# EasyEDA Pro project arm project files.epro

# Schematic Schematic1_3
Board Name: PCB2_1; Create Date: 2025-11-03; Page Name: P1; Project Name: arm only; Schematic Name: Schematic1_3; Update Date: 2025-11-03; Company: EasyEDA.com; Page Size: A4; Version: V1.0
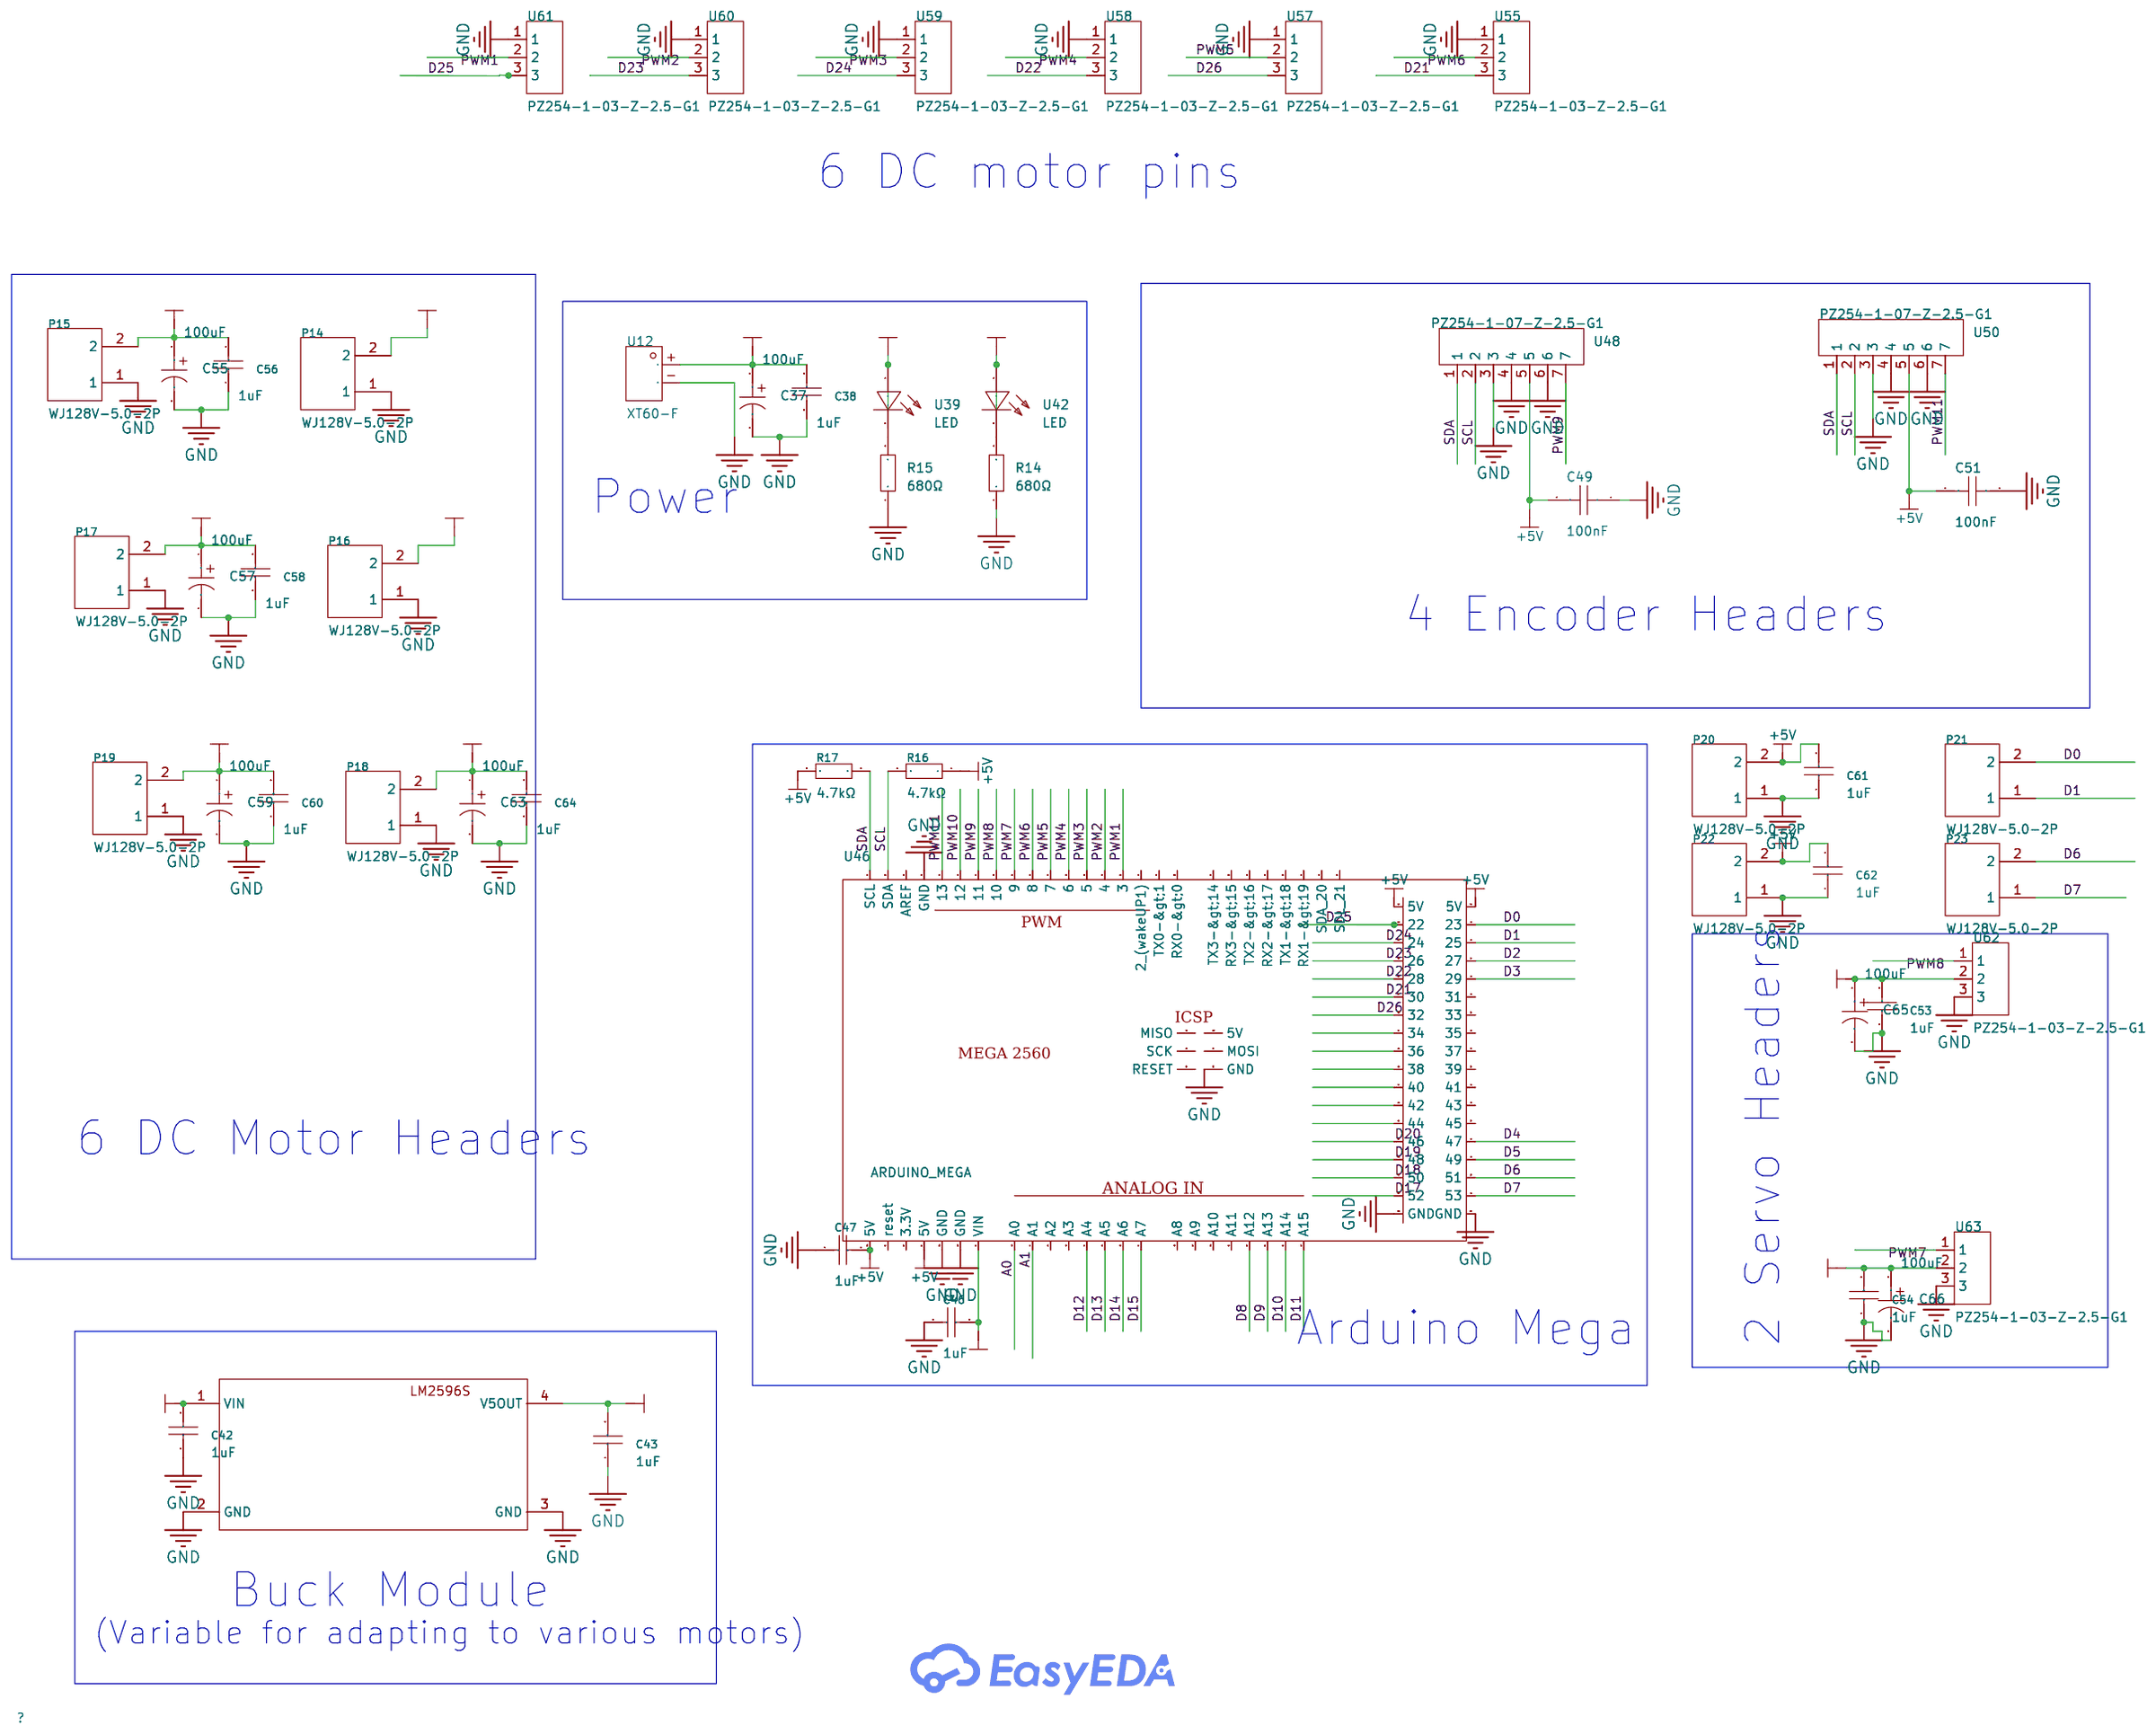
[diagram p0: schematic sheet]

## Parts
C37  100uF  [CAP-TH_BD10.0-P5.00-D0.6-FD]
C38  1uF  [C0805]
C42  1uF  [C0805]
C43  1uF  [C0805]
C46  1uF  [C0805]
C47  1uF  [C0805]
C49  100nF  [C0805]
C51  100nF  [C0805]
C53  1uF  [C0805]
C54  1uF  [C0805]
C55  100uF  [CAP-TH_BD10.0-P5.00-D0.6-FD]
C56  1uF  [C0805]
C57  100uF  [CAP-TH_BD10.0-P5.00-D0.6-FD]
C58  1uF  [C0805]
C59  100uF  [CAP-TH_BD10.0-P5.00-D0.6-FD]
C60  1uF  [C0805]
C61  1uF  [C0805]
C62  1uF  [C0805]
C63  100uF  [CAP-TH_BD10.0-P5.00-D0.6-FD]
C64  1uF  [C0805]
C65  100uF  [CAP-TH_BD10.0-P5.00-D0.6-FD]
C66  100uF  [CAP-TH_BD10.0-P5.00-D0.6-FD]
P14  WJ128V-5.0-2P  [CONN-TH_2P-P5.00_WJ128V-5.0-2P]
P15  WJ128V-5.0-2P  [CONN-TH_2P-P5.00_WJ128V-5.0-2P]
P16  WJ128V-5.0-2P  [CONN-TH_2P-P5.00_WJ128V-5.0-2P]
P17  WJ128V-5.0-2P  [CONN-TH_2P-P5.00_WJ128V-5.0-2P]
P18  WJ128V-5.0-2P  [CONN-TH_2P-P5.00_WJ128V-5.0-2P]
P19  WJ128V-5.0-2P  [CONN-TH_2P-P5.00_WJ128V-5.0-2P]
P20  WJ128V-5.0-2P  [CONN-TH_2P-P5.00_WJ128V-5.0-2P]
P21  WJ128V-5.0-2P  [CONN-TH_2P-P5.00_WJ128V-5.0-2P]
P22  WJ128V-5.0-2P  [CONN-TH_2P-P5.00_WJ128V-5.0-2P]
P23  WJ128V-5.0-2P  [CONN-TH_2P-P5.00_WJ128V-5.0-2P]
R14  680Ω  [R0805]
R15  680Ω  [R0805]
R16  4.7kΩ  [R1206]
R17  4.7kΩ  [R1206]
U12  XT60-F  [CONN-TH_XT60PB-F]
U13  776dda36e34043c08ff071d6b0b84ffa  [LM2596S_FP]
U39  LED  [LED-TH_BD4.0-P2.54-FD_RED]
U42  LED  [LED-TH_BD4.0-P2.54-FD_RED]
U46  ARDUINO_MEGA  [ARDUINO_MEGA2560]
U48  PZ254-1-07-Z-2.5-G1  [HDR-TH_7P-P2.54-V-M]
U50  PZ254-1-07-Z-2.5-G1  [HDR-TH_7P-P2.54-V-M]
U55  PZ254-1-03-Z-2.5-G1  [HDR-TH_3P-P2.54-V-M]
U57  PZ254-1-03-Z-2.5-G1  [HDR-TH_3P-P2.54-V-M]
U58  PZ254-1-03-Z-2.5-G1  [HDR-TH_3P-P2.54-V-M]
U59  PZ254-1-03-Z-2.5-G1  [HDR-TH_3P-P2.54-V-M]
U60  PZ254-1-03-Z-2.5-G1  [HDR-TH_3P-P2.54-V-M]
U61  PZ254-1-03-Z-2.5-G1  [HDR-TH_3P-P2.54-V-M]
U62  PZ254-1-03-Z-2.5-G1  [HDR-TH_3P-P2.54-V-M]
U63  PZ254-1-03-Z-2.5-G1  [HDR-TH_3P-P2.54-V-M]

## Library data of the parts
C37 C55 C57 C59 C63 C65 C66 = 100V100uF CD288: Capacitance:100uF Tolerance:±20% Tolerance:±20% Voltage Rating:100V Pin Spacing:5mm Diameter:10mm Height - Seated (Max):20mm Operating Temperature:-40℃~+105℃ Operating Temperature:-40℃~+105℃; LCSC Part Name: 100uF ±20% 100V; Supplier Part: C2960285; Manufacturer: HRK(鸿瑞凯电子); Supplier Footprint: 插件,D10xL20mm; JLCPCB Part Class: Extended Part; Supplier: LCSC; Tolerance: ±20%; Voltage Rating: 100V; Pin Spacing: 5mm; Diameter: 10mm; Height - Seated (Max): 20mm; Operating Temperature: -40℃~+105℃
C38 C42 C43 C46 C47 C53 C54 C56 C58 C60-C62 C64 = CC0805KKX7R8BB105: Capacitance: Tolerance:±10% Tolerance:±10% Voltage Rated: Temperature Coefficient:; LCSC Part Name: 1uF ±10% 25V; Supplier Part: C91186; Manufacturer: YAGEO(国巨); Supplier Footprint: 0805; JLCPCB Part Class: Extended Part; Datasheet: https://atta.szlcsc.com/upload/public/pdf/source/20170505/1493957848374.pdf; Supplier: LCSC; Tolerance: ±10%
C49 C51 = C0805X104K101T_C485772: Capacitance:100nF Tolerance:±10% Tolerance:±10% Voltage Rating:100V Temperature Coefficient:X7R; LCSC Part Name: 100nF ±10% 100V; Supplier Part: C485772; Manufacturer: IHHEC(禾伸堂); Manufacturer Part: C0805X104K101T; Supplier Footprint: 0805; JLCPCB Part Class: Extended Part; Datasheet: https://item.szlcsc.com/datasheet/C0805X104K101T/494187.html; Supplier: LCSC; Tolerance: ±10%; Voltage Rating: 100V; Temperature Coefficient: X7R
P14-P23 = WJ128V-5.0-2P: Structure:1x2P Pitch:5mm Color:Green Mounting Style:Straight Current Rating (Max):20A Voltage Rating (Max):250V Number of Pins:2P Number of Rows:1 Wire Gauge - AWG:12~22 Wire Gauge - AWG:12~22 Wire Gauge - mm2:2.5 Wire Gauge - mm2:2.5 Number of PINs Per R; LCSC Part Name: 5mm 1x2P 排数:1 每排P数:2 直插; Supplier Part: C8269; Manufacturer: KANGNEX(康奈克斯电气); Supplier Footprint: 插件,P=5mm; JLCPCB Part Class: Extended Part; Datasheet: https://atta.szlcsc.com/upload/public/pdf/source/20191225/C8269_1FF44D6D2E83DB14A7CA266A410FD9AD.pdf; Supplier: LCSC; Structure: 1x2P; Pitch: 5mm; Color: Green; Mounting Style: Straight; Current Rating (Max): 20A; Voltage Rating (Max): 250V; Number of Pins: 2P; Number of Rows: 1; Wire Gauge - AWG: 12~22; Wire Gauge - mm2: 2.5; Number of PINs Per Row: 2; Operating Temperature Range: -40℃~+105℃
R14 R15 = CR0805F86800G: Type:Thick Film Resistor Resistance:680Ω Tolerance:±1% Tolerance:±1% Power(Watts):125mW Voltage-Supply(Max):150V Temperature Coefficient:±100ppm/℃ Temperature Coefficient:±100ppm/℃ Operating Temperature:-55℃~+125℃ Operating Temperature:-55℃~+125℃; LCSC Part Name: 厚膜电阻 680Ω ±1% 125mW; Supplier Part: C101832; Manufacturer: LIZ(丽智电子); Supplier Footprint: 0805; JLCPCB Part Class: Extended Part; Datasheet: https://item.szlcsc.com/datasheet/CR0805F86800G/103047.html; Supplier: LCSC; Type: Thick Film Resistor; Tolerance: ±1%; Power(Watts): 125mW; Voltage-Supply(Max): 150V; Temperature Coefficient: ±100ppm/℃; Operating Temperature: -55℃~+125℃
R16 R17 = RMC12064.7K5%N: Type:Thick Film Resistor Resistance:4.7kΩ Tolerance:±5% Tolerance:±5% Power(Watts):250mW Voltage-Supply(Max):200V Temperature Coefficient:±100ppm/℃ Temperature Coefficient:±100ppm/℃ Operating Temperature:-55℃~+155℃ Operating Temperature:-55℃~+155℃; LCSC Part Name: 厚膜电阻 4.7kΩ ±5% 250mW; Supplier Part: C269760; Manufacturer: Tyohm(幸亚电阻); Supplier Footprint: 1206; JLCPCB Part Class: Extended Part; Datasheet: https://item.szlcsc.com/datasheet/RMC12064.7K5%2525N/259200.html; Supplier: LCSC; Type: Thick Film Resistor; Tolerance: ±5%; Power(Watts): 250mW; Voltage-Supply(Max): 200V; Temperature Coefficient: ±100ppm/℃; Operating Temperature: -55℃~+155℃
U12 = XT60-F: Power:- Output:- Input:- Size:- Interface:- Type:- Colour:Yellow MaximumCurrent:- Type:Banana plug RatedVoltage:- Type1:- NumberOfUSBHoles:- InterfaceType:Female MetalMaterial:Gold plating InsulationMaterial:- RatedCurrent:- RecommendedWireGauge:- FlameRe; LCSC Part Name: AMASS(艾迈斯)XT60模型插头 3.5mm镀金香蕉头母头 XT60-F; Supplier Part: C98734; Manufacturer: AMASS(艾迈斯); JLCPCB Part Class: Extended Part; Datasheet: https://item.szlcsc.com/datasheet/XT60-F/99944.html; Supplier: LCSC; Type: Banana plug; Colour: Yellow; InterfaceType: Female; MetalMaterial: Gold plating
U13 = LM2596S: 5V Buck converter
U39 U42 = LED: Supplier Part: C9900015665; Supplier Footprint: SIP-2P; JLCPCB Part Class: Extended Part; Supplier: LCSC
U46 = ARDUINO_MEGA: Manufacturer Part: ARDUINO MEGA
U48 U50 = PZ254-1-07-Z-2.5-G1: Pin Structure:1x7P Pitch:2.54mm Row Spacing:- Circluar Pins/Square Pins:Pin Header Mounting Type:Through Hole Number of Rows:1 Number of Pins:7P Current Rating:3A Length of Mating Pin:6mm Insulation Height:2.5mm Length of End Connection Pin:3mm Contact Ma; LCSC Part Name: 1x7P 间距:2.54mm 方针 直插; Supplier Part: C18197914; Manufacturer: HCTL(华灿天禄); Supplier Footprint: 插件,P=2.54mm; Datasheet: https://item.szlcsc.com/datasheet/PZ254-1-07-Z-2.5-G1/19348280.html; Supplier: LCSC; Pin Structure: 1x7P; Pitch: 2.54mm; Circluar Pins/Square Pins: Pin Header; Mounting Type: Through Hole; Number of Rows: 1; Number of Pins: 7P; Current Rating: 3A; Length of Mating Pin: 6mm; Insulation Height: 2.5mm; Length of End Connection Pin: 3mm; Contact Material: Brass; Operating Temperature: -40℃~+105℃; Color: Black
U55 U57-U63 = PZ254-1-03-Z-2.5-G1: Pin Structure:1x3P Pitch:2.54mm Row Spacing:- Circluar Pins/Square Pins:Pin Header Mounting Type:Through Hole Number of Rows:1 Number of Pins:3P Current Rating:3A Length of Mating Pin:6mm Insulation Height:2.5mm Length of End Connection Pin:3mm Contact Ma; LCSC Part Name: 1x3P 间距:2.54mm 方针 直插; Supplier Part: C18197910; Manufacturer: HCTL(华灿天禄); Supplier Footprint: 插件,P=2.54mm; JLCPCB Part Class: Extended Part; Datasheet: https://item.szlcsc.com/datasheet/PZ254-1-03-Z-2.5-G1/19348276.html; Supplier: LCSC; Pin Structure: 1x3P; Pitch: 2.54mm; Circluar Pins/Square Pins: Pin Header; Mounting Type: Through Hole; Number of Rows: 1; Number of Pins: 3P; Current Rating: 3A; Length of Mating Pin: 6mm; Insulation Height: 2.5mm; Length of End Connection Pin: 3mm; Contact Material: Brass; Operating Temperature: -40℃~+105℃; Color: Black

## Nets
+5V: C47.2 C49.2 C51.2 C61.2 C62.2 P20.2 P22.2 R16.1 R17.2 U46.5V U46.5V.(5V) U46.5V..(5V) U46.5V...(5V) U48.5 U50.5
+8V: C43.2 C46.2 C53.2 C54.2 C65.1 C66.1 U13.4(V5OUT) U42.1(+) U46.VIN U62.2 U63.2
GND: C37.2 C38.1 C42.1 C43.1 C46.1 C47.1 C49.1 C51.1 C53.1 C54.1 C55.2 C56.1 C57.2 C58.1 C59.2 C60.1 C61.1 C62.1 C63.2 C64.1 C65.2 C66.2 P14.1 P15.1 P16.1 P17.1 P18.1 P19.1 P20.1 P22.1 R14.1 R15.1 U12.-(2) U13.2(GND) U13.3(GND) U46.GND U48.3 U48.4 U48.6 U50.3 U50.4 U50.6 U55.1 U57.1 U58.1 U59.1 U60.1 U61.1 U62.3 U63.3
VIN: C37.1 C38.2 C42.2 C55.1 C56.2 C57.1 C58.2 C59.1 C60.2 C63.1 C64.2 P14.2 P15.2 P16.2 P17.2 P18.2 P19.2 U12.+(1) U13.1(VIN) U39.1(+)
A0: U46.78(A0)
A1: U46.77(A1)
D0: P21.2 U46.30(23)
D1: P21.1 U46.32(25)
D2: U46.34(27)
D3: U46.36(29)
D4: U46.54(47)
D5: U46.56(49)
D6: P23.2 U46.58(51)
D7: P23.1 U46.60(53)
D8: U46.66(A12)
D9: U46.65(A13)
D10: U46.64(A14)
D11: U46.63(A15)
D12: U46.74(A4)
D13: U46.73(A5)
D14: U46.72(A6)
D15: U46.71(A7)
D17: U46.59(52)
D18: U46.57(50)
D19: U46.55(48)
D20: U46.53(46)
D21: U46.37(30) U55.3
D22: U46.35(28) U58.3
D23: U46.33(26) U60.3
D24: U46.31(24) U59.3
D25: U46.29(22) U61.3
D26: U46.39(32) U57.3
PWM1: U46.15(3) U61.2
PWM2: U46.14(4) U60.2
PWM3: U46.13(5) U59.2
PWM4: U46.12(6) U58.2
PWM5: U46.11(7) U57.2
PWM6: U46.10(8) U55.2
PWM7: U46.9 U63.1
PWM8: U46.8(10) U62.1
PWM9: U46.7(11) U48.7
PWM10: U46.6(12)
PWM11: U46.5(13) U50.7
SCL: R16.2 U46.SDA U48.2 U50.2
SDA: R17.1 U46.SCL U48.1 U50.1
$1N17276: R14.2 U42.2(-)
$1N17277: R15.2 U39.2(-)

Not connected (* = marked no-connect by the designer): U46 3(AREF) 5VICSP(5V) 16(2 (wakeUP1)) 17(TX0-&gt;1) 18(RX0-&gt;0) 19(TX3-&gt;14) 20(RX3-&gt;15) 21(TX2-&gt;16) 22(RX2-&gt;17) 23(TX1-&gt;18) 24(RX1-&gt;19) 38(31) 40(33) 41(34) 42(35) 43(36) 44(37) 45(38) 46(39) 47(40) 48(41) 49(42) 50(43) 51(44) 52(45) 67(A11) 68(A10) 69(A9) 70(A8) 75(A3) 76(A2) 83(3.3V) 84(reset) 86(MISO) 87(SCK) 88(RESET) 90(MOSI) SCL2(SDL 21) SDA2(SDA 20)

## Notes on the sheet
- 6 DC motor pins
- Power
- 4 Encoder Headers
- 6 DC Motor Headers
- Arduino Mega
- 2 Servo Headers
- Buck Module
- (Variable for adapting to various motors)

# Board PCB2_1
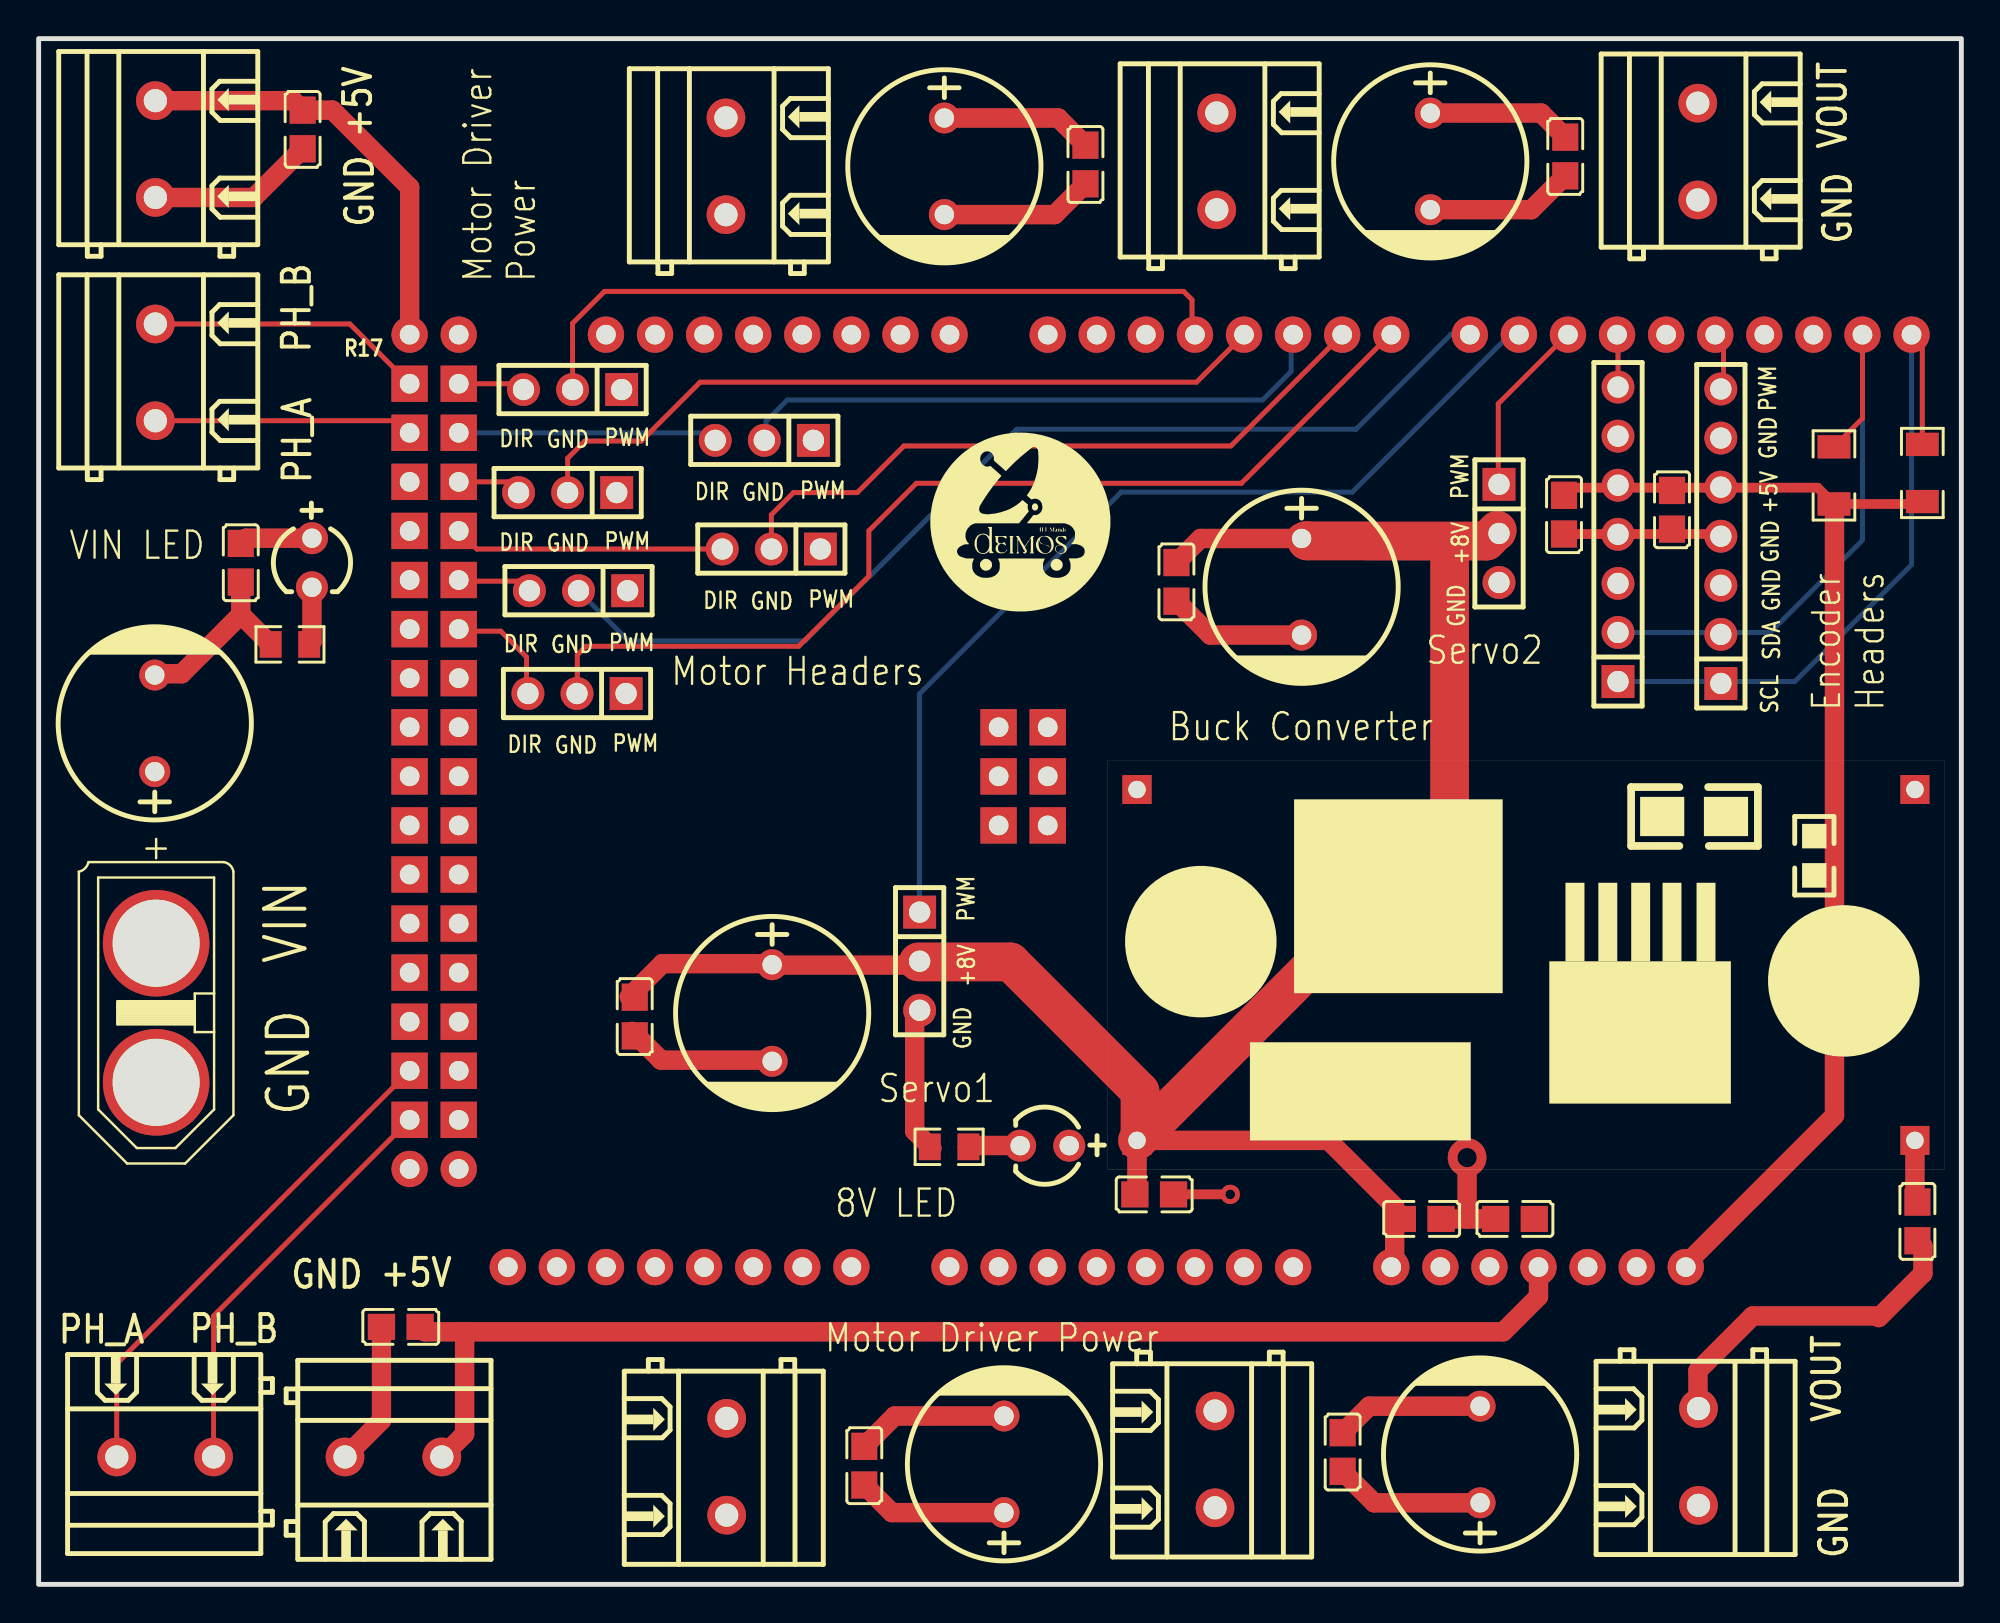
[diagram p1: board, top side]
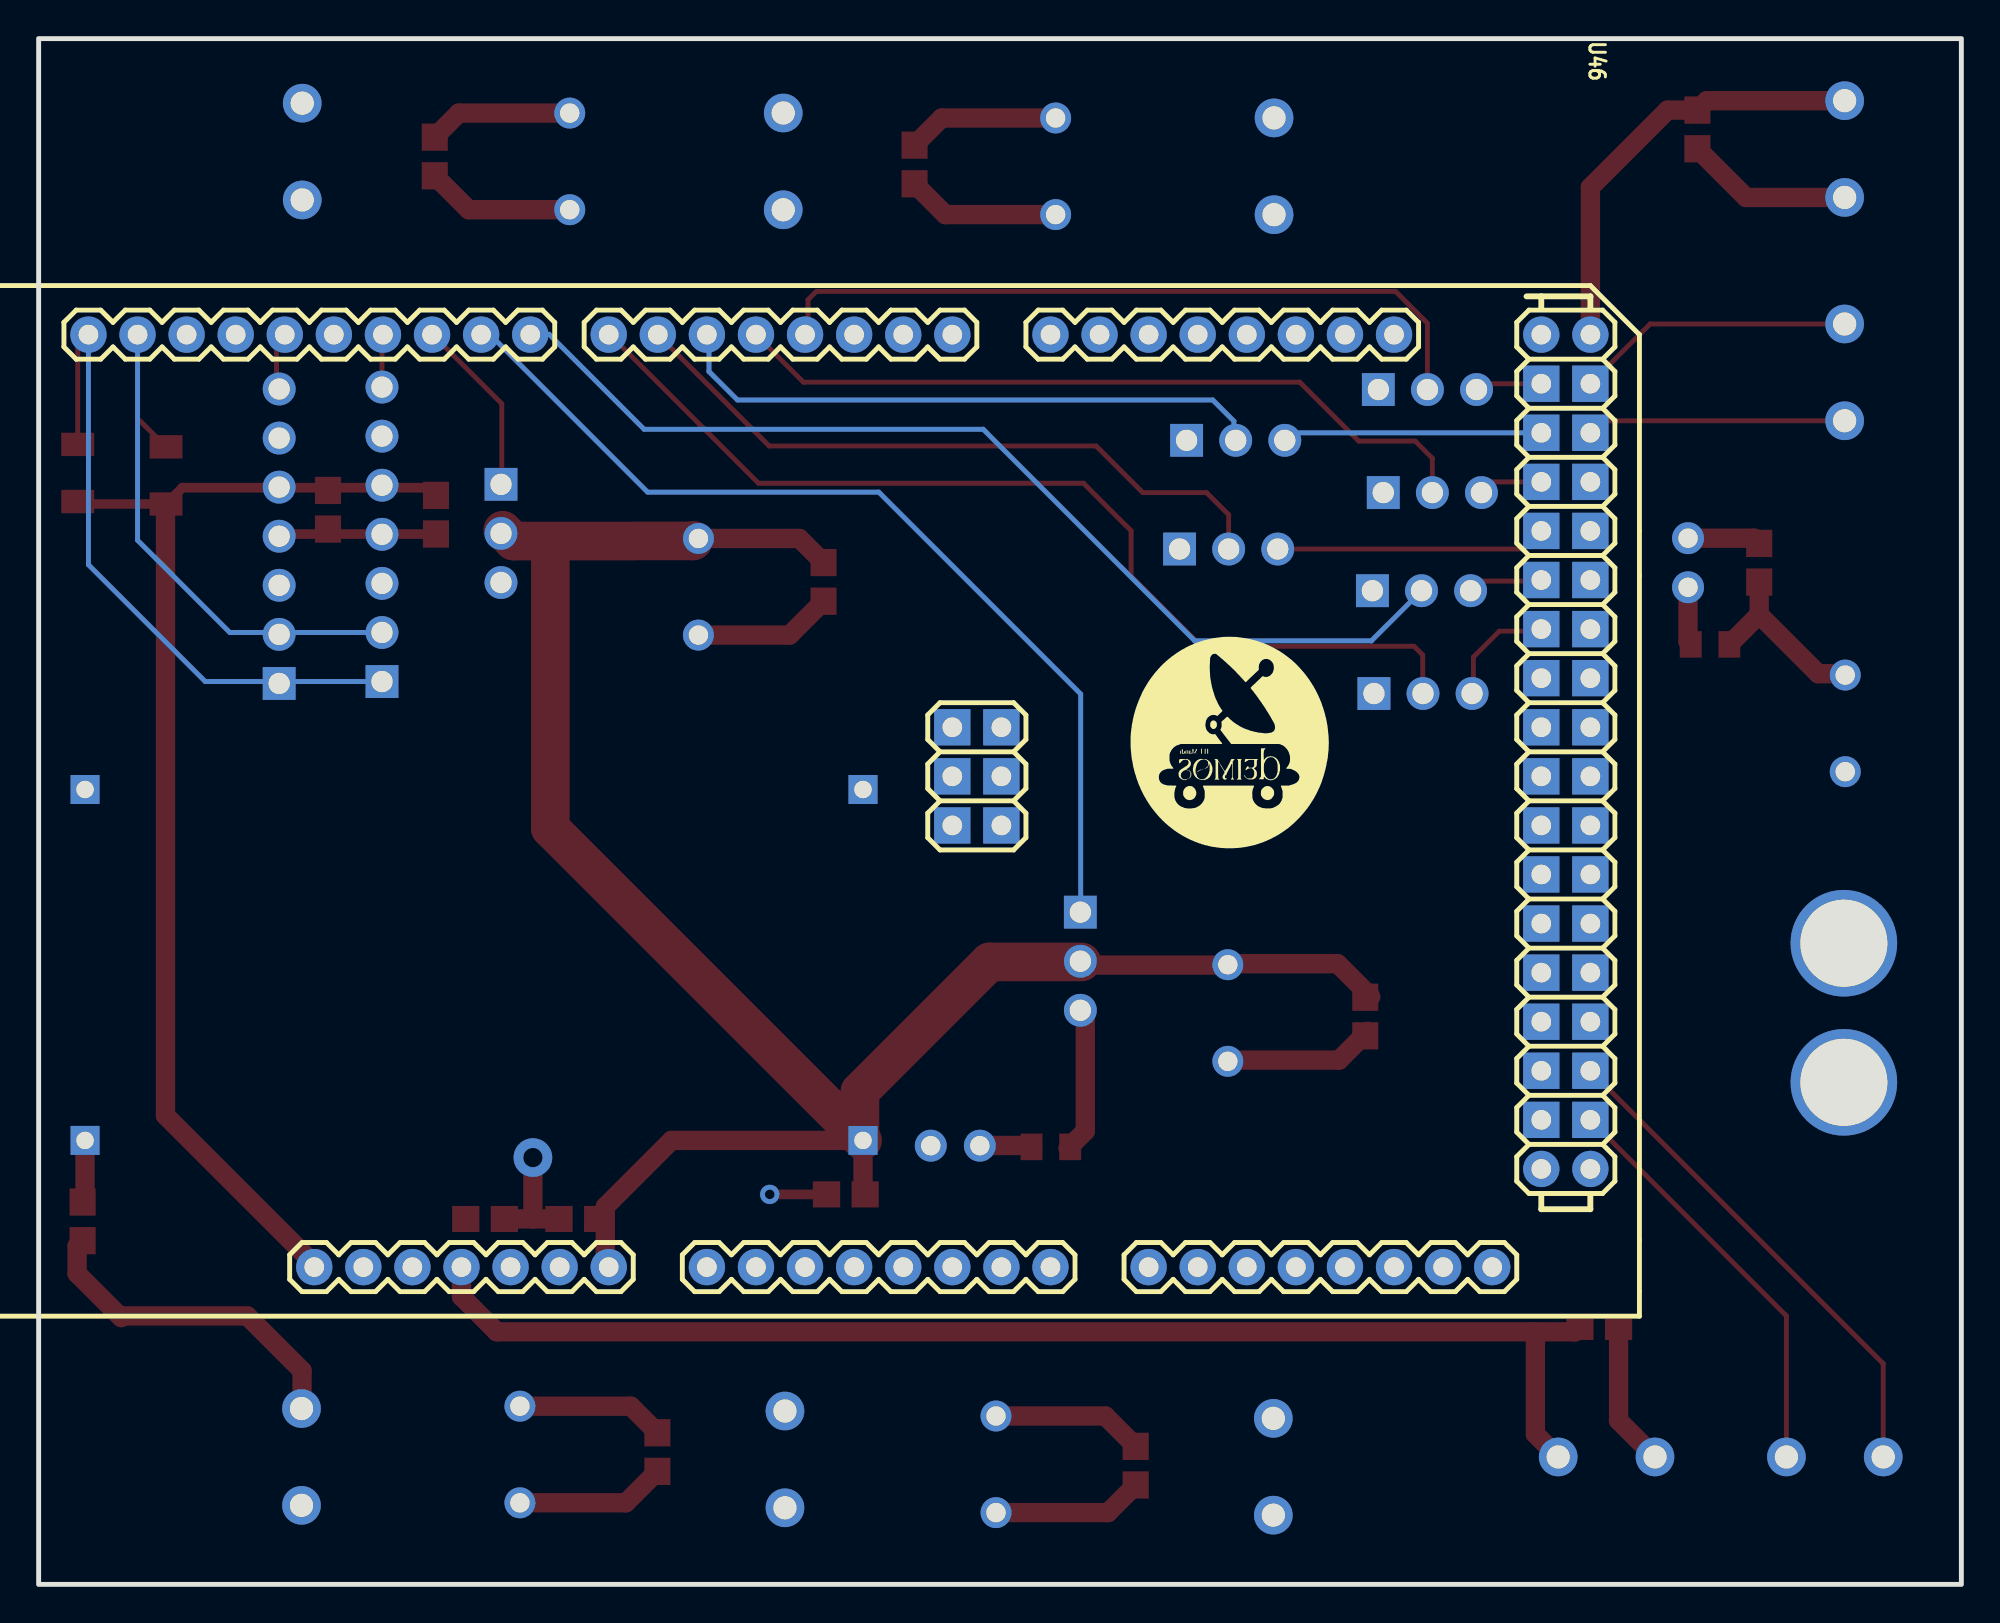
[diagram p2: board, bottom side, seen from below]

Outline 99.5 x 80 mm; copper layers: Top Layer, Inner1, Inner2, Bottom Layer. Coordinates in mm from the lower left corner of the outline.
Outline path: rectangle 0,80 99.5,0
Stack: Top Layer 0.035mm Outer layer thickness 1oz / Dielectric1 0.2104mm 7628 RC49% 8.6mil / Inner1 0.0152mm Inner layer thickness / Dielectric2 1.065mm 1.1mm H/HOZ Copper / Inner2 0.0152mm Inner layer thickness / Dielectric3 0.2104mm 7628 RC49% 8.6mil / Bottom Layer 0.035mm Outer layer thickness 1oz

## Design rules (mm)
template: JLCPCB Capability(Two Layers Board)
spacing copperThickness1oz (default): track to track 0.102, other pairs 0.152 to 0.3
spacing copperThickness2oz: track to track 0.203, other pairs 0.152 to 0.3
track width copperThickness1oz (default): min 0.127, default 0.254, max 2.54
track width copperThickness2oz: min 0.203, default 0.254, max 2.54
differential pair differentialPair (default): width min 0.127, default 0.254, max 2.54; gap min 0.152, default 0.152
via viaSize (default): diameter min 0.5, default 0.61, max 10; hole min 0.3, default 0.305, max 6.3

## Placement (name value [footprint] x y rotation side)
C37  100uF  [CAP-TH_BD10.0-P5.00-D0.6-FD]  6.01 44.56 90 top
C38  1uF  [C0805]  10.46 52.88 90 top
C42  1uF  [C0805]  97.23 18.79 90 top
C43  1uF  [C0805]  57.73 20.18 180 top
C46  1uF  [C0805]  71.57 18.91 180 top
C47  1uF  [C0805]  76.4 18.91 0 top
C49  100nF  [C0805]  78.94 55.36 90 top
C51  100nF  [C0805]  84.53 55.62 90 top
C53  1uF  [C0805]  58.88 51.88 90 top
C54  1uF  [C0805]  30.85 29.39 90 top
C55  100uF  [CAP-TH_BD10.0-P5.00-D0.6-FD]  46.87 73.39 270 top
C56  1uF  [C0805]  54.17 73.49 90 top
C57  100uF  [CAP-TH_BD10.0-P5.00-D0.6-FD]  72.02 73.65 270 top
C58  1uF  [C0805]  79 73.9 90 top
C59  100uF  [CAP-TH_BD10.0-P5.00-D0.6-FD]  74.59 6.72 90 top
C60  1uF  [C0805]  67.48 6.85 270 top
C61  1uF  [C0805]  13.66 75.3 90 top
C62  1uF  [C0805]  18.74 13.32 0 top
C63  100uF  [CAP-TH_BD10.0-P5.00-D0.6-FD]  49.96 6.21 90 top
C64  1uF  [C0805]  42.73 6.14 270 top
C65  100uF  [CAP-TH_BD10.0-P5.00-D0.6-FD]  65.36 51.63 270 top
C66  100uF  [CAP-TH_BD10.0-P5.00-D0.6-FD]  37.96 29.57 270 top
P14  WJ128V-5.0-2P  [CONN-TH_2P-P5.00_WJ128V-5.0-2P]  35.57 73.39 90 top
P15  WJ128V-5.0-2P  [CONN-TH_2P-P5.00_WJ128V-5.0-2P]  60.97 73.65 90 top
P16  WJ128V-5.0-2P  [CONN-TH_2P-P5.00_WJ128V-5.0-2P]  85.86 74.16 90 top
P17  WJ128V-5.0-2P  [CONN-TH_2P-P5.00_WJ128V-5.0-2P]  35.61 6.09 270 top
P18  WJ128V-5.0-2P  [CONN-TH_2P-P5.00_WJ128V-5.0-2P]  60.88 6.47 270 top
P19  WJ128V-5.0-2P  [CONN-TH_2P-P5.00_WJ128V-5.0-2P]  85.9 6.59 270 top
P20  WJ128V-5.0-2P  [CONN-TH_2P-P5.00_WJ128V-5.0-2P]  18.36 6.59 0 top
P21  WJ128V-5.0-2P  [CONN-TH_2P-P5.00_WJ128V-5.0-2P]  6.04 62.73 90 top
P22  WJ128V-5.0-2P  [CONN-TH_2P-P5.00_WJ128V-5.0-2P]  6.04 74.28 90 top
P23  WJ128V-5.0-2P  [CONN-TH_2P-P5.00_WJ128V-5.0-2P]  6.55 6.59 180 top
R14  680Ω  [R0805]  47.12 22.64 0 top
R15  680Ω  [R0805]  13 48.65 0 top
R16  4.7kΩ  [R1206]  92.91 57.39 90 top
R17  4.7kΩ  [R1206]  97.48 57.52 270 top
U12  XT60-F  [CONN-TH_XT60PB-F]  6.08 29.58 90 top
U13  776dda36e34043c08ff071d6b0b84ffa  [LM2596S_FP]  76.91 31.99 180 top
U39  LED  [LED-TH_BD4.0-P2.54-FD_RED]  14.14 52.88 270 top
U42  LED  [LED-TH_BD4.0-P2.54-FD_RED]  52.06 22.7 180 top
U46  ARDUINO_MEGA  [ARDUINO_MEGA2560]  67.59 43.73 180 bottom
U48  PZ254-1-07-Z-2.5-G1  [HDR-TH_7P-P2.54-V-M]  81.73 54.35 90 top
U50  PZ254-1-07-Z-2.5-G1  [HDR-TH_7P-P2.54-V-M]  87.05 54.25 90 top
U55  PZ254-1-03-Z-2.5-G1  [HDR-TH_3P-P2.54-V-M]  27.94 51.43 180 top
U57  PZ254-1-03-Z-2.5-G1  [HDR-TH_3P-P2.54-V-M]  27.86 46.11 180 top
U58  PZ254-1-03-Z-2.5-G1  [HDR-TH_3P-P2.54-V-M]  37.92 53.58 180 top
U59  PZ254-1-03-Z-2.5-G1  [HDR-TH_3P-P2.54-V-M]  37.55 59.21 180 top
U60  PZ254-1-03-Z-2.5-G1  [HDR-TH_3P-P2.54-V-M]  27.38 56.5 180 top
U61  PZ254-1-03-Z-2.5-G1  [HDR-TH_3P-P2.54-V-M]  27.63 61.84 180 top
U62  PZ254-1-03-Z-2.5-G1  [HDR-TH_3P-P2.54-V-M]  75.57 54.39 270 top
U63  PZ254-1-03-Z-2.5-G1  [HDR-TH_3P-P2.54-V-M]  45.59 32.25 270 top

## Footprints (pads in the part's own frame, mm; a bottom-side part is the same pattern mirrored in y, then rotated)
ARDUINO_MEGA2560
  round 1.879 hole 1.016: 3(-24.256,20.954) 5(-19.177,20.954) 5V(-10.033,-27.305) 5V.(45.847,20.954) 5V..(48.388,20.954) 5V...(-17.652,-27.305) 6(-16.637,20.954) 7(-14.097,20.954) 8(-11.556,20.954) 9(-9.017,20.954) 10(-6.476,20.954) 11(-2.413,20.954) 12(0.128,20.954) 13(2.667,20.954) 14(5.207,20.954) 15(7.747,20.954) 16(10.287,20.954) 17(12.828,20.954) 18(15.367,20.954) 19(20.448,20.954) 20(22.988,20.954) 21(25.527,20.954) 22(28.067,20.954) 23(30.608,20.954) 24(33.148,20.954) 63(43.307,-27.305) 64(40.767,-27.305) 65(38.227,-27.305) 66(35.688,-27.305) 67(33.148,-27.305) 68(30.608,-27.305) 69(28.067,-27.305) 70(25.527,-27.305) 71(20.448,-27.305) 72(17.907,-27.305) 73(15.367,-27.305) 74(12.828,-27.305) 75(10.287,-27.305) 76(7.747,-27.305) 77(5.207,-27.305) 78(2.667,-27.305) 83(-12.572,-27.305) 84(-15.113,-27.305) 91(45.847,-22.226) 92(48.388,-22.226) 93(-7.492,-27.305) 94(-4.952,-27.305) GND(-21.716,20.954) SCL(-29.337,20.954) SCL2(38.227,20.954) SDA(-26.797,20.954) SDA2(35.688,20.954) VIN(-2.413,-27.305)
  rect 1.879x1.879 hole 1.016: 5VICSP(17.907,0.635) 29(45.847,18.415) 30(48.387,18.415) 31(45.847,15.875) 32(48.387,15.875) 33(45.847,13.335) 34(48.387,13.335) 35(45.847,10.795) 36(48.387,10.795) 37(45.847,8.255) 38(48.387,8.255) 39(45.847,5.715) 40(48.387,5.715) 41(45.847,3.175) 42(48.387,3.175) 43(45.847,0.635) 44(48.387,0.635) 45(45.847,-1.905) 46(48.387,-1.905) 47(45.847,-4.445) 48(48.387,-4.445) 49(45.847,-6.985) 50(48.387,-6.985) 51(45.847,-9.525) 52(48.387,-9.525) 53(45.847,-12.065) 54(48.387,-12.065) 55(45.847,-14.605) 56(48.387,-14.605) 57(45.847,-17.145) 58(48.387,-17.145) 59(45.847,-19.685) 60(48.387,-19.685) 86(15.367,0.635) 87(15.367,-1.905) 88(15.367,-4.445) 90(17.907,-1.905) 95(17.907,-4.445)
C0805
  rect 1.41x1.35 smd: 1(-1,0) 2(1,0)
CAP-TH_BD10.0-P5.00-D0.6-FD
  round 1.6 hole 1: 1(-2.5,0) 2(2.5,0)
CONN-TH_2P-P5.00_WJ128V-5.0-2P
  round 2 hole 1.2: 1(-2.505,0) 2(2.505,0)
CONN-TH_XT60PB-F
  round 5.516 hole 4.505x4.5: +(3.6,0) -(-3.6,0)
HDR-TH_3P-P2.54-V-M
  rect 1.7x1.7 hole 1.1: 1(-2.54,0)
  round 1.7 hole 1.1: 2(0,0) 3(2.54,0)
HDR-TH_7P-P2.54-V-M
  rect 1.7x1.7 hole 1.1: 1(-7.62,0)
  round 1.7 hole 1.1: 2(-5.08,0) 3(-2.54,0) 4(0,0) 5(2.54,0) 6(5.08,0) 7(7.62,0)
LED-TH_BD4.0-P2.54-FD_RED
  round 1.651 hole 1: 1(-1.27,0) 2(1.27,0)
LM2596S_FP
  rect 1.5x1.5 hole 0.9: 1(-20.193,9.017) 2(-20.193,-9.144) 3(20.066,-9.144) 4(20.066,9.017)
R0805
  rect 1.133x1.377 smd: 1(-1,0) 2(1,0)
R1206
  rect 1.208x1.701 smd: 1(-1.479,0) 2(1.479,0)

## Nets
As in the schematic.

Pads without a net: U46 3 5VICSP 16 17 18 19 20 21 22 23 24 38 40 42 44 46 48 50 52 67 68 69 70 75 76 83 84 86 87 88 90 91 92 93 94 95 SCL2 SDA2

## Via types
v1: diameter 1, hole 0.5, Top Layer to Bottom Layer, 1 via
v2: diameter 2, hole 1, Top Layer to Bottom Layer, 1 via

## Routing (per net, layer and track width the routed paths; a pad name or vN(x,y) marks a point on that pad's centre or on a via; arc(x,y) is an arc through that point)
+5V: length 151.5
  Top Layer w0.5: R17.2 97.35,55.91 R16.1 92.06,56.76 79.34,56.76 C49.2
  Top Layer w1: P20.2 22.04,7.77 22.04,13.07 ; 92.94,55.66 92.94,24.27 85.08,16.41 ; 22.04,13.07 75.79,13.07 77.62,14.9 77.62,16.42 ; 22.04,13.07 19.99,13.07 C62.2 ; P22.2 13.17,76.79 C61.2 15.2,76.3 19.2,72.3 U46.5V..
+8V: length 107.1
  Top Layer w1: C43.2 56.84,20.29 56.84,22.96 ; 30.56,30.41 32.28,32.12 38.02,32.12 ; C65.1 60.13,54.13 C53.2 ; 56.86,22.98 66.75,22.98 70.18,19.55 70.18,16.6 70,16.42 ; 38.16,32.05 45.21,32.05
  Top Layer w2: 57,23.2 57,25.51 50.29,32.21 45.52,32.21 ; 75.48,54.56 74.93,54 68.78,54 ; 68.62,54 65.64,54 65.61,54.03 ; 56.86,22.98 73.02,39.13 73.02,53.89
GND: length 113.3
  Top Layer w0.5: C49.1 87.05,54.36 87.19,54.22 ; C43.1 v1(61.67,20.18)
  Top Layer w1: C60.1 68.86,9.22 C59.2 ; C53.1 60.63,49.13 C65.2 ; 73.92,18.91 C47.1 ; 73.92,18.91 v2(73.92,22.09) ; 73.92,18.91 C46.1 ; P22.1 11.14,71.78 C61.1 ; C58.1 77.25,71.15 C57.2 ; C55.2 52.58,70.89 C56.1 ; 10.39,50.11 7.4,47.13 6.06,47.13 ; 95.14,13.89 88.7,13.89 85.87,11.06 85.87,9.04 85.9,9.01 ; 45.34,29.35 45.34,23.46 46.23,22.57 ; C62.1 17.74,8.48 P20.1 ; 30.71,28.62 32.2,27.13 37.64,27.13 ; 95.23,13.8 97.51,16.09 97.51,17.5 C42.1 ; C63.2 44.3,8.71 C64.1 ; 11.84,48.82 10.46,50.19 C38.1
VIN: length 38
  Top Layer w1: U39.1 10.73,54.15 C38.2 ; C57.1 77.76,76.15 C58.2 ; C64.2 44.16,3.71 C63.1 ; U13.1 97.1,19.91 C42.2 ; C56.2 52.77,75.89 C55.1 ; C59.1 69.11,4.22 C60.2
D0: length 14.4
  Top Layer w0.254: P21.2 16.11,65.23 U46.30
D1: length 13.4
  Top Layer w0.254: P21.1 18.58,60.22 U46.32
D6: length 26.3
  Top Layer w0.254: U46.58 4.04,11.42 P23.2
D7: length 21.6
  Top Layer w0.254: U46.60 9.05,13.89 P23.1
D21: length 4.1
  Top Layer w0.254: 25.43,51.29 24.79,51.92 21.63,51.92
D22: length 14
  Top Layer w0.254: U46.35 22.67,53.58 U58.3
D23: length 3.3
  Top Layer w0.254: U60.3 24.28,57.06 U46.33
D24: length 13.6
  Bottom Layer w0.254: 35.11,59.26 34.78,59.6 21.66,59.6
D25: length 3.5
  Top Layer w0.254: U46.29 24.79,62.14 U61.3
D26: length 6.1
  Top Layer w0.254: 21.67,49.33 23.91,49.33 25.25,47.99 25.25,45.98
PWM1: length 38.2
  Top Layer w0.254: U61.2 27.63,65.27 29.28,66.92 59.25,66.92 59.69,66.49 59.69,64.83 U46.15
PWM2: length 39.4
  Top Layer w0.254: U46.14 59.92,62.22 34.23,62.22 31.19,59.17 28.26,59.17 27.38,58.28 U60.2
PWM3: length 31.4
  Bottom Layer w0.254: 37.65,59.11 37.65,60.21 38.74,61.3 63.34,61.3 64.81,62.77 64.81,64.81
PWM4: length 35.2
  Top Layer w0.254: U46.12 61.7,58.92 44.78,58.92 42.36,56.5 39.06,56.5 37.92,55.36 U58.2
PWM5: length 52.1
  Top Layer w0.254: 27.88,46.54 27.88,48.1 28.32,48.55 39.33,48.55 42.97,52.18 42.97,54.53 45.42,56.99 62.24,56.99 70.12,64.87
PWM6: length 54
  Bottom Layer w0.254: 74.15,64.7 73.09,64.7 68.17,59.78 50.62,59.78 39.67,48.83 30.53,48.83 27.85,51.51
PWM7: length 50.1
  Bottom Layer w0.254: 45.63,34.62 45.57,34.68 45.57,46.08 56.03,56.53 67.98,56.53 76.37,64.91
PWM8: length 9.5
  Top Layer w0.254: 79.33,64.9 75.53,61.1 75.53,56.97
PWM9: length 2.7
  Top Layer w0.254: U46.7 81.73,64.63 U48.7
PWM11: length 3
  Top Layer w0.254: U46.5 87.19,64.25 87.19,61.84
SCL: length 31.7
  Top Layer w0.254: U46.SDA 94.38,60.35 R16.2
  Bottom Layer w0.254: U48.2 89.61,49.27 94.38,54.04 U46.SDA
SDA: length 35.5
  Top Layer w0.254: U46.SCL 97.48,64.12 R17.1
  Bottom Layer w0.254: U46.SCL 96.92,52.77 90.88,46.73 81.73,46.73
$1N17276: length 2.7
  Top Layer w1: 48.06,22.64 48.13,22.71 50.7,22.71
$1N17277: length 3
  Top Layer w1: R15.2 14.14,48.79 U39.2

## Copper pours and planes (outline as drawn; the poured copper is in the pictures)
GND on Inner2: 0.26,79.74 99.24,79.74 99.24,0.26 0.26,0.26
VIN on Inner1: 0.26,79.74 99.24,79.74 99.24,0.26 0.26,0.26

Small or netless copper shapes (teardrops, artwork), in the pictures only: 56 on Inner1, 130 on Inner2

## Text on the board
Bottom Silkscreen Layer: U46
Top Silkscreen Layer: R17 | PWM | GND | +5V | SCL | SDA | DIR | +8V | VIN LED | 8V LED | Encoder / Headers | Motor Headers | Servo1 | Servo2 | Motor Driver / Power | Motor Driver Power | Buck Converter | VOUT | PH_A | PH_B | VIN
